# Altium schematic sheet SubPowerr.SchDoc: Sub Power of Power Bar
size 381 x 193 mm; Author: Staok; DrawnBy: Staok; Revision: 3.14
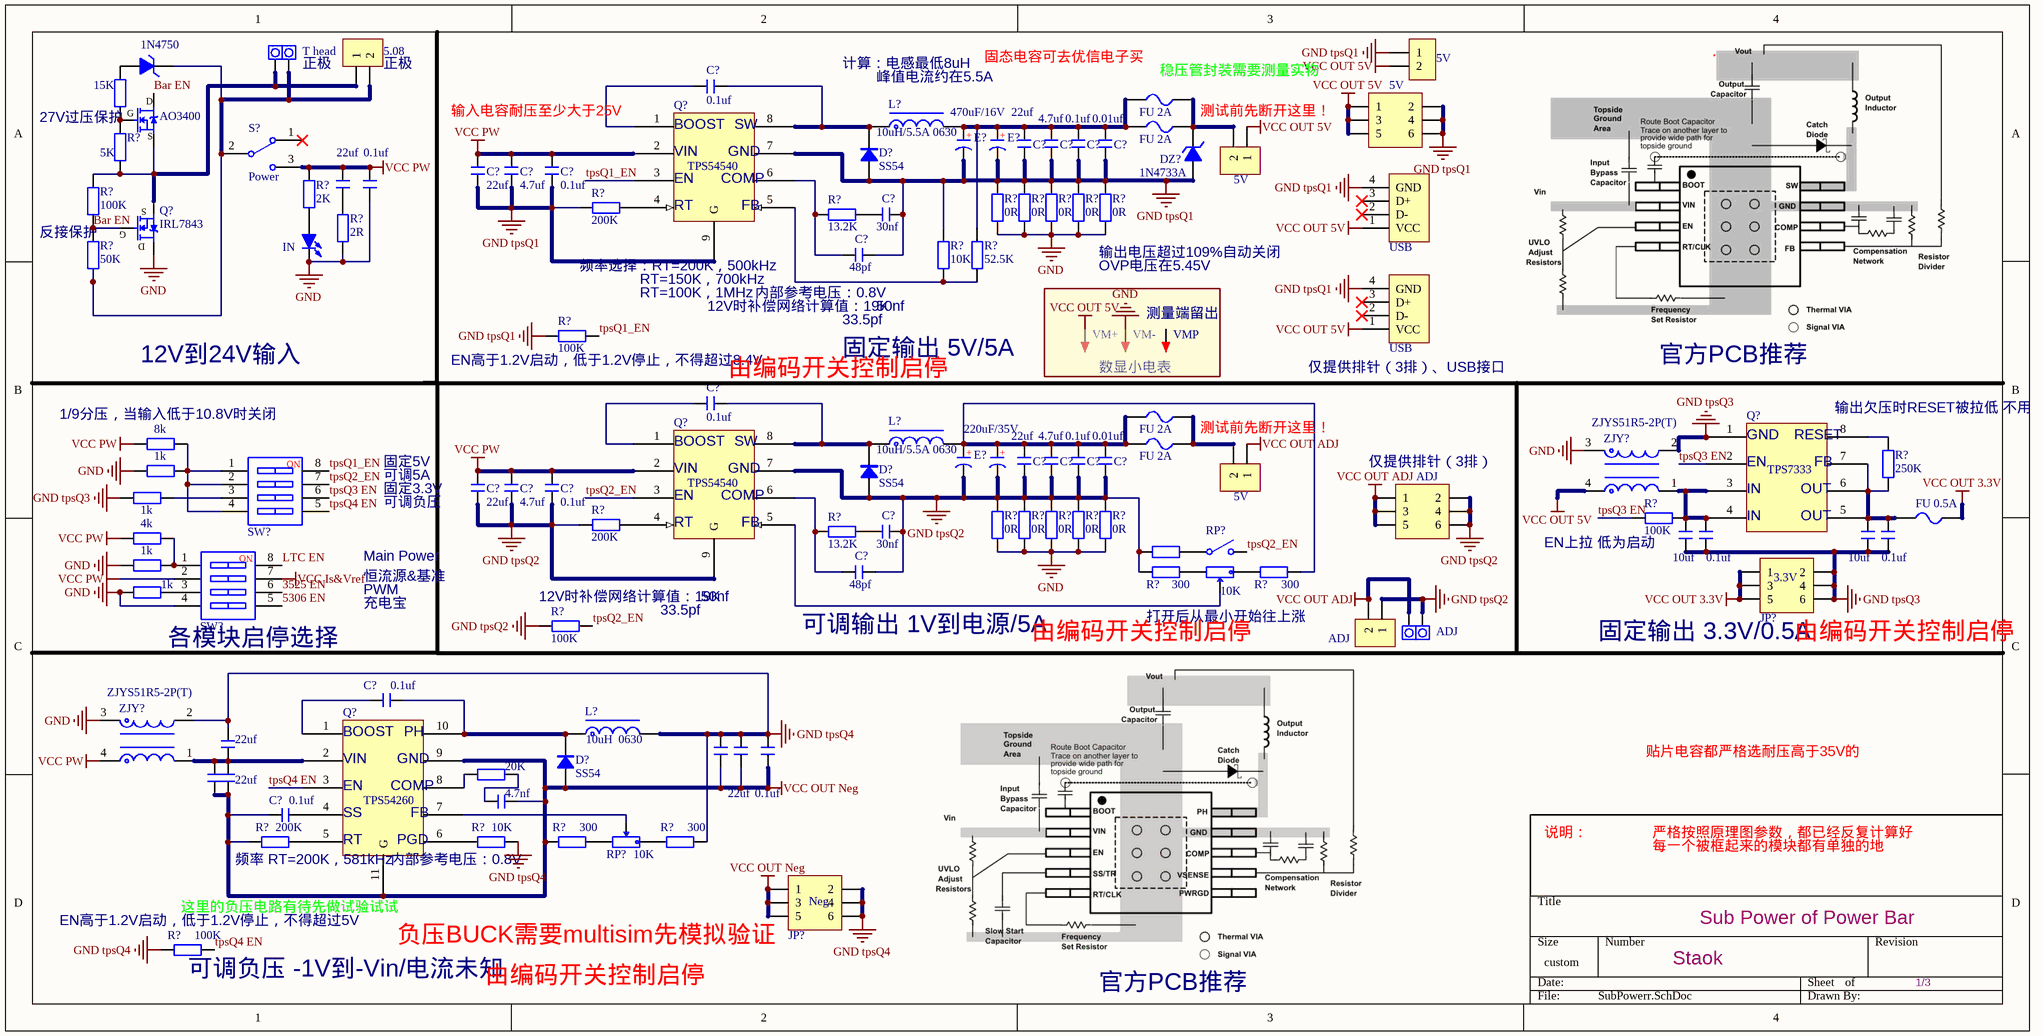
[diagram p0: SubPowerr.SchDoc]

## Parts
(Parts that share a designator on the sheet are numbered #1, #2 ... from top to bottom, then left to right.)
C?#1  0.1uf  [C 0805_L]
C?#2  22uf  [C 0805_L]
C?#3  4.7uf  [C 0805_L]
C?#4  0.1uf  [C 0805_L]
C?#5  0.01uf  [C 0805_L]
C?#6  22uf  [C 0805_L]
C?#7  4.7uf  [C 0805_L]
C?#8  0.1uf  [C 0805_L]
C?#9  22uf  [C 0805_L]
C?#10  0.1uf  [C 0805_L]
C?#11  30nf  [C 0805_L]
C?#12  48pf  [C 0805_L]
C?#13  0.1uf  [C 0805_L]
C?#14  22uf  [C 0805_L]
C?#15  4.7uf  [C 0805_L]
C?#16  0.1uf  [C 0805_L]
C?#17  0.01uf  [C 0805_L]
C?#18  22uf  [C 0805_L]
C?#19  4.7uf  [C 0805_L]
C?#20  0.1uf  [C 0805_L]
C?#21  30nf  [C 0805_L]
C?#22  10uf  [C 0805_L]
C?#23  0.1uf  [C 0805_L]
C?#24  10uf  [C 0805_L]
C?#25  0.1uf  [C 0805_L]
C?#26  48pf  [C 0805_L]
C?#27  0.1uf  [C 0805_L]
C?#28  22uf  [C 0805_L]
C?#29  22uf  [C 0805_L]  (value not drawn)
C?#30  22uf  [C 0805_L]
C?#31  0.1uf  [C 0805_L]
C?#32  22uf  [C 0805_L]  (value not drawn)
C?#33  22uf  [C 0805_L]
C?#34  4.7nf  [C 0805_L]
C?#35  0.1uf  [C 0805_L]
D?#1  SS54  [SMA]
D?#2  SS54  [SMA]
D?#3  SS54  [SMA]
DZ?#1  1N4750  [DO-41GV]
DZ?#2  1N4733A  [DO-41GV]
E?#1  470uF/16V  [CS 2.5*6.3*11 - R]
E?#2  470uF/16V  [CS 2.5*6.3*11 - R]  (value not drawn)
E?#3  220uF/35V  [CS 3.5*8*11.5 - R]
E?#4  220uF/35V  [CS 3.5*8*11.5 - R]  (value not drawn)
F?#1  FU 2A  [FU 1812]
F?#2  FU 2A  [FU 1812]
F?#3  FU 2A  [FU 1812]
F?#4  FU 2A  [FU 1812]
F?#5  FU 0.5A  [FU 0805]
H?#1  T head  [T Head]
H?#2  ADJ  [T Head]
JP?#1  5V  [KF128-5.08-2P]
JP?#2  5.08  [KF128-5.08-2P]
JP?#3  5V  [HDR2.54-LI-2x3P]
JP?#4  5V  [HDR2.54-LI-2P]
JP?#5  5V  [HDR2.54-LI-2P]
JP?#6  ADJ  [HDR2.54-LI-2x3P]
JP?#7  3.3V  [HDR2.54-LI-2x3P]
JP?#8  ADJ  [KF128-5.08-2P]
JP?#9  Neg  [HDR2.54-LI-2x3P]
L?#1  10uH/5.5A 0630  [L-SMD-0630]
L?#2  10uH/5.5A 0630  [L-SMD-0630]
L?#3  10uH  0630  [L-SMD-0630]
LED?  IN  [LED 0805B]
Q?#1  AO3400  [SOT23-3N]
Q?#2  TPS54540  [ESOP8_M]
Q?#3  IRL7843  [TO252]
Q?#4  TPS7333  [SOP8_N]
Q?#5  TPS54540  [ESOP8_M]
Q?#6  TPS54260  [ESOP10]
R?#1  15K  [R 0805_L]
R?#2  5K  [R 0805_L]
R?#3  200K  [R 0805_L]
R?#4  13.2K  [R 0805_L]
R?#5  2K  [R 0805_L]
R?#6  100K  [R 0805_L]
R?#7  10K  [R 0805_L]
R?#8  52.5K  [R 0805_L]
R?#9  0R  [R 0805_L]
R?#10  0R  [R 0805_L]
R?#11  0R  [R 0805_L]
R?#12  0R  [R 0805_L]
R?#13  0R  [R 0805_L]
R?#14  2R  [R 0805_L]
R?#15  50K  [R 0805_L]
R?#16  100K  [R 0805_L]
R?#17  8k  [R 0805_L]
R?#18  1k  [R 0805_L]
R?#19  250K  [R 0805_L]
R?#20  1k  [R 0805_L]
R?#21  100K  [R 0805_L]
R?#22  200K  [R 0805_L]
R?#23  13.2K  [R 0805_L]
R?#24  4k  [R 0805_L]
R?#25  0R  [R 0805_L]
R?#26  0R  [R 0805_L]
R?#27  0R  [R 0805_L]
R?#28  0R  [R 0805_L]
R?#29  0R  [R 0805_L]
R?#30  100  [R 0805_L]  (value not drawn)
R?#31  1k  [R 0805_L]
R?#32  300  [R 0805_L]
R?#33  300  [R 0805_L]
R?#34  1k  [R 0805_L]
R?#35  100K  [R 0805_L]
R?#36  20K  [R 0805_L]
R?#37  200K  [R 0805_L]
R?#38  10K  [R 0805_L]
R?#39  300  [R 0805_L]
R?#40  300  [R 0805_L]
R?#41  100K  [R 0805_L]
RP?#1  10K  [RV097-K-1-G15]
RP?#2  10K  [RV097-1-G15]
S?  Power  [MTS-10x]
SW?#1  CSW-4P  [CSW2.54 SMD-4P]  (value not drawn)
SW?#2  CSW-4P  [CSW2.54 SMD-4P]  (value not drawn)
TP?#1  VM+  [TEST 2.0]
TP?#2  VM-  [TEST 2.0]
TP?#3  VMP  [TEST 2.0]
USB?#1  USB  [USB-A/S_A]
USB?#2  USB  [USB-A/S_A]
ZJY?#1  ZJYS51R5-2P(T)  [ZJYS51R5-2P(T)]
ZJY?#2  ZJYS51R5-2P(T)  [ZJYS51R5-2P(T)]

## Nets
GND: C?#10.1 LED?.2(K) Q?#3.2(S) R?#9.1 R?#10.1 R?#11.1 R?#12.1 R?#13.1 R?#14.1 R?#18.1 R?#25.1 R?#26.1 R?#27.1 R?#28.1 R?#29.1 R?#31.2 R?#34.2 SW?#2.4 TP?#2.1 ZJY?#1.3 ZJY?#2.3
GND tpsQ1: C?#2.1 C?#3.1 C?#4.1 C?#5.1 C?#6.1 C?#7.1 C?#8.1 C?#11.1 C?#12.1 D?#1.1(A) DZ?#2.1(A) E?#1.2(K) E?#2.2(K) JP?#1.1 JP?#3.2 JP?#3.4 JP?#3.6 Q?#2.7 Q?#2.9(G) R?#3.2 R?#7.1 R?#9.2 R?#10.2 R?#11.2 R?#12.2 R?#13.2 R?#16.1 USB?#1.4(GND) USB?#2.4(GND)
GND tpsQ2: C?#14.1 C?#15.1 C?#16.1 C?#17.1 C?#18.1 C?#19.1 C?#20.1 C?#21.1 C?#26.1 D?#2.1(A) E?#3.2(K) E?#4.2(K) H?#2.1 JP?#6.2 JP?#6.4 JP?#6.6 JP?#8.1 Q?#5.7 Q?#5.9(G) R?#22.2 R?#25.2 R?#26.2 R?#27.2 R?#28.2 R?#29.2 R?#30.2 R?#32.2 R?#35.1
GND tpsQ3: C?#22.1 C?#23.1 C?#24.1 C?#25.1 JP?#7.2 JP?#7.4 JP?#7.6 Q?#4.1 R?#20.2 ZJY?#1.2
GND tpsQ4: C?#28.1 C?#29.2 C?#30.2 C?#31.2 JP?#9.2 JP?#9.4 JP?#9.6 L?#3.2 R?#38.1 R?#40.1 R?#41.1 ZJY?#2.2
VCC Is&Vref: SW?#2.7
VCC OUT 3.3V: F?#5.2 JP?#7.1 JP?#7.3 JP?#7.5
VCC OUT 5V: JP?#1.2 JP?#3.1 JP?#3.3 JP?#3.5 JP?#4.1 TP?#1.1 USB?#1.1(VCC) USB?#2.1(VCC) ZJY?#1.4
VCC OUT ADJ: H?#2.2 JP?#5.1 JP?#6.1 JP?#6.3 JP?#6.5 JP?#8.2
VCC OUT Neg: C?#29.1 C?#30.1 C?#31.1 C?#32.1 C?#33.1 C?#34.1 C?#35.2 D?#3.1(A) JP?#9.1 JP?#9.3 JP?#9.5 Q?#6.9 Q?#6.11(G) R?#37.2 R?#39.2
VCC PW: C?#6.2 C?#7.2 C?#8.2 C?#9.2 C?#10.2 C?#18.2 C?#19.2 C?#20.2 Q?#2.2 Q?#5.2 R?#5.2 R?#17.1 R?#24.2 S?.3 SW?#2.2 ZJY?#2.4
3525 EN: SW?#2.6
5306 EN: SW?#2.5
Bar EN: Q?#1.3(D) Q?#3.1(G) R?#6.1 R?#15.2
LTC EN: SW?#2.8
tpsQ1_EN: Q?#2.3 R?#16.2 SW?#1.8
tpsQ2_EN: Q?#5.3 R?#35.2 RP?#1.4 SW?#1.7
tpsQ3 EN: Q?#4.2 R?#21.2 SW?#1.6
tpsQ4 EN: Q?#6.3 R?#41.2 SW?#1.5
NetC?#1_1: C?#1.1 D?#1.2(K) L?#1.1 Q?#2.8
NetC?#1_2: C?#1.2 Q?#2.1
NetC?#2_2: C?#2.2 C?#3.2 C?#4.2 C?#5.2 E?#1.1(A) E?#2.1(A) F?#1.1 F?#2.1 L?#1.2 R?#8.1
NetC?#9_1: C?#9.1 R?#14.2
NetC?#11_2: C?#11.2 R?#4.1
NetC?#12_2: C?#12.2 Q?#2.6 R?#4.2
NetC?#13_1: C?#13.1 D?#2.2(K) L?#2.1 Q?#5.8
NetC?#13_2: C?#13.2 Q?#5.1
NetC?#14_2: C?#14.2 C?#15.2 C?#16.2 C?#17.2 E?#3.1(A) E?#4.1(A) F?#3.1 F?#4.1 L?#2.2 R?#33.2
NetC?#21_2: C?#21.2 R?#23.1
NetC?#22_2: C?#22.2 C?#23.2 Q?#4.3 Q?#4.4 R?#21.1 ZJY?#1.1
NetC?#24_2: C?#24.2 C?#25.2 F?#5.1 Q?#4.5 Q?#4.6 Q?#4.7 R?#19.1
NetC?#26_2: C?#26.2 Q?#5.6 R?#23.2
NetC?#27_1: C?#27.1 Q?#6.1
NetC?#27_2: C?#27.2 D?#3.2(K) L?#3.1 Q?#6.10
NetC?#28_2: C?#28.2 C?#32.2 C?#33.2 Q?#6.2 ZJY?#2.1
NetC?#34_2: C?#34.2 R?#36.2
NetC?#35_1: C?#35.1 Q?#6.4
NetDZ?#1_1: DZ?#1.1(A) R?#1.2
NetDZ?#1_2: DZ?#1.2(K) H?#1.2 JP?#2.2 R?#15.1 S?.2
NetDZ?#2_2: DZ?#2.2(K) F?#1.2 F?#2.2 JP?#4.2
NetF?#3_2: F?#3.2 F?#4.2 JP?#5.2
NetH?#1_1: H?#1.1 JP?#2.1 Q?#1.2(S) Q?#3.3(D) R?#2.1 R?#6.2
NetLED?_1: LED?.1(A) R?#5.1
NetQ?#1_1: Q?#1.1(G) R?#1.1 R?#2.2
NetQ?#2_4: Q?#2.4 R?#3.1
NetQ?#2_5: Q?#2.5 R?#7.2 R?#8.2
NetQ?#4_8: Q?#4.8 R?#19.2
NetQ?#5_4: Q?#5.4 R?#22.1
NetQ?#5_5: Q?#5.5 RP?#1.2
NetQ?#6_5: Q?#6.5 R?#37.1
NetQ?#6_6: Q?#6.6 R?#38.2
NetQ?#6_7: Q?#6.7 RP?#2.2
NetQ?#6_8: Q?#6.8 R?#36.1
NetR?#17_2: R?#17.2 R?#18.2 SW?#1.1 SW?#1.2 SW?#1.4
NetR?#20_1: R?#20.1 SW?#1.3
NetR?#24_1: R?#24.1 R?#31.1 SW?#2.1
NetR?#30_1: R?#30.1 RP?#1.5
NetR?#32_1: R?#32.1 RP?#1.3
NetR?#33_1: R?#33.1 RP?#1.1
NetR?#34_1: R?#34.1 SW?#2.3
NetR?#39_1: R?#39.1 RP?#2.3
NetR?#40_2: R?#40.2 RP?#2.1

Not connected (* = marked no-connect by the designer): S? 1*; TP?#3 1; USB?#1 2(D-)* 3(D+)*; USB?#2 2(D-)* 3(D+)*

## Notes on the sheet
- (near H?#1) 正极
- (near JP?#2) 正极
- (near C?#6) 输入电容耐压至少大于25V
- 计算：电感最低8uH
- 峰值电流约在5.5A
- 固态电容可去优信电子买
- (near F?#1) 稳压管封装需要测量实物
- 测试前先断开这里！
- (near R?#1) 27V过压保护
- (near Q?#2) BOOST
- (near Q?#2) VIN
- (near Q?#2) GND
- (near Q?#2) SW
- (near R?#15) 反接保护
- (near Q?#2) EN
- (near Q?#2) RT
- (near Q?#2) COMP
- (near Q?#2) FB
- 频率选择：RT=200K，500kHz
- RT=150K，700kHz
- RT=100K，1MHz
- 12V时补偿网络计算值：19K
- (near C?#12) 内部参考电压：0.8V
- 50nf
- (near R?#13) 输出电压超过109%自动关闭
- (near R?#13) OVP电压在5.45V
- 12V到24V输入
- (near R?#16) EN高于1.2V启动，低于1.2V停止，不得超过8.4V
- (near C?#13) 由编码开关控制启停
- 33.5pf
- 固定输出 5V/5A
- (near TP?#2) 数显小电表
- (near TP?#3) 测量端留出
- (near USB?#2) 仅提供排针（3排）、USB接口
- 官方PCB推荐
- (near R?#17) 1/9分压，当输入低于10.8V时关闭
- (near Q?#5) BOOST
- (near Q?#5) SW
- (near Q?#4) GND
- (near Q?#4) RESET
- 输出欠压时RESET被拉低 不用
- 固定5V
- (near C?#18) 固定3.3V
- 可调负压
- 可调5A
- (near Q?#5) VIN
- (near Q?#5) EN
- (near Q?#5) COMP
- (near Q?#5) GND
- (near JP?#6) 仅提供排针（3排）
- (near Q?#4) EN
- (near Q?#4) IN
- (near Q?#4) OUT
- (near Q?#4) FB
- 恒流源&基准
- Main Power
- (near Q?#5) RT
- (near Q?#5) FB
- EN上拉 低为启动
- 各模块启停选择
- 充电宝
- PWM
- (near R?#35) 12V时补偿网络计算值：19K
- (near Q?#5) 50nf
- (near C?#26) 可调输出 1V到电源/5A
- (near R?#32) 由编码开关控制启停
- 打开后从最小开始往上涨
- (near JP?#7) 固定输出 3.3V/0.5A
- (near JP?#7) 由编码开关控制启停
- (near Q?#6) BOOST
- (near Q?#6) VIN
- (near Q?#6) EN
- (near Q?#6) COMP
- (near Q?#6) GND
- (near Q?#6) PH
- 贴片电容都严格选耐压高于35V的
- (near Q?#6) SS
- (near Q?#6) RT
- (near Q?#6) PGD
- (near Q?#6) FB
- 说明：
- 严格按照原理图参数，都已经反复计算好
- 每一个被框起来的模块都有单独的地
- (near R?#41) EN高于1.2V启动，低于1.2V停止，不得超过5V
- (near R?#41) 这里的负压电路有待先做试验试试
- (near Q?#6) 频率 RT=200K，581kHz
- (near Q?#6) 内部参考电压：0.8V
- (near R?#41) 可调负压 -1V到-Vin/电流未知
- 负压BUCK需要multisim先模拟验证
- 由编码开关控制启停
- 1/3
- (in symbol C-CS) +
- (in symbol CSW-4P) NO

## Library data of the parts
C?#1-C?#35 = C: 无极性贴片电容; 版权归属: 源创客; 材质: X7R; BOM名称: 无极性贴片电容; 学习资源: www.ooocke.com
D?#1-D?#3 = SS54: 肖特基二极管; 版权归属: 源创客; 属性: 40V/3A; BOM名称: 肖特基二极管; 学习资源: www.ooocke.com
DZ?#1 DZ?#2 = 1N4620: 3.3V/0.5W稳压管; 版权归属: 源创客; BOM名称: 3.3V/0.5W稳压管; 学习资源: www.ooocke.com
E?#1-E?#4 = C-CS: 直插固态电容; 版权归属: 源创客; BOM名称: 直插固态电容; 学习资源: www.ooocke.com
F?#1-F?#5 = FU: 贴片保险丝; 版权归属: 源创客; BOM名称: 贴片保险丝; 学习资源: www.ooocke.com
H?#1 H?#2 = PAD2: 引线焊盘; 版权归属: 源创客; BOM名称: 引线焊盘; 学习资源: www.ooocke.com
JP?#1 JP?#2 JP?#4 JP?#5 JP?#8 = Header 2: 2P接插件; 版权归属: 源创客; BOM名称: 2P接插件; 学习资源: www.ooocke.com
JP?#3 JP?#6 JP?#7 JP?#9 = Header 3X2: 3*2P接插件; 版权归属: 源创客; BOM名称: 3*2P接插件; 学习资源: www.ooocke.com
L?#1-L?#3 = L-CD: 贴片功率电感; BOM名称: 功率电感; 版权归属: 源创客; 学习资源: www.ooocke.com
LED? = LED-SMD: 贴片LED; 版权归属: 源创客; BOM名称: 贴片LED; 学习资源: www.ooocke.com
Q?#1 = AO3400: N沟道 30V/4.2A; BOM名称: 场效应管; 版权归属: 源创客; 学习资源: www.ooocke.com; 描述: N沟道 30V/4.2A
Q?#2 Q?#5 = ESOP8
Q?#3 = IRF3710: N沟道 100V/57A; BOM名称: 场效应管; 版权归属: 源创客; 学习资源: www.ooocke.com; 描述: N沟道 100V/57A
Q?#4 = 8
Q?#6 = ESOP10
R?#1-R?#41 = R: 贴片电阻; 版权归属: 源创客; BOM名称: 贴片电阻; 学习资源: www.ooocke.com
RP?#1 = RP-KEY-ID: 插件单联开关型电位器; BOM名称: 开关型电位器; 版权归属: 源创客; 学习资源: www.ooocke.com
RP?#2 = RP-ID: 插件单联电位器; BOM名称: 插件电位器; 版权归属: 源创客; 学习资源: www.ooocke.com
S? = MTS-10x: MTS10x系列3脚扭子开关; 版权归属: 源创客; BOM名称: MTS10x系列3脚扭子开关; 学习资源: www.ooocke.com
SW?#1 SW?#2 = CSW-4P: 4路编码开关; 版权归属: 源创客; BOM名称: 4路编码开关; 学习资源: www.ooocke.com
TP?#1-TP?#3 = TEST: 测试点; 版权归属: 源创客; BOM名称: 测试点; 学习资源: www.ooocke.com
USB?#1 USB?#2 = USB-A/S: USB-A型母接口; 版权归属: 源创客; BOM名称: USB-A型母接口; 学习资源: www.ooocke.com